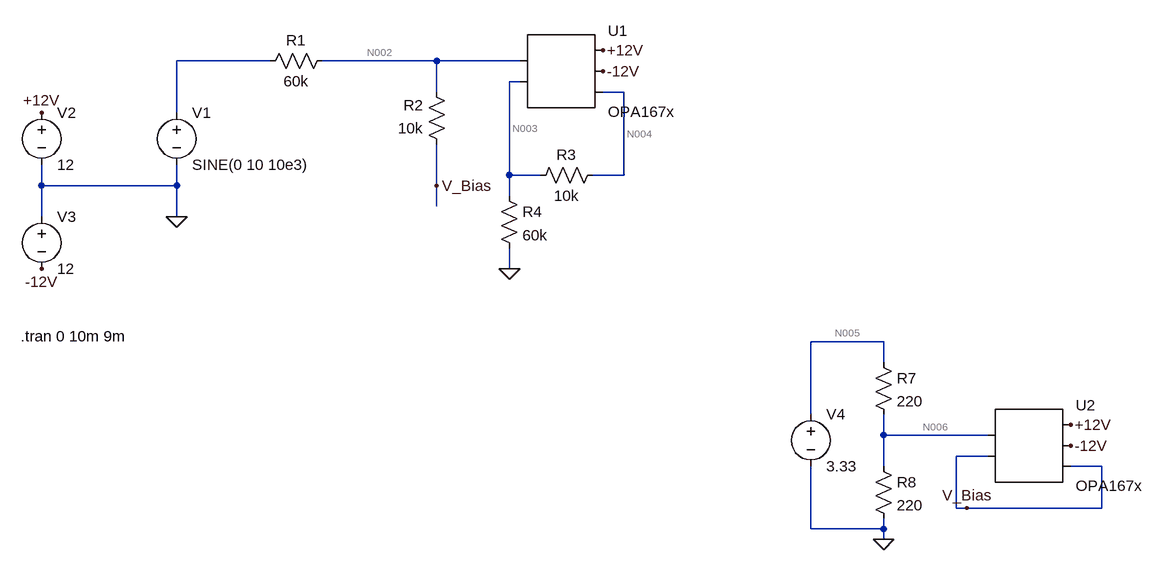
[diagram p0: schematic AnalogInput.asc]
* AnalogInput.asc
V1 N001 0 SINE(0 10 10e3)
V2 +12V 0 12
V3 0 -12V 12
* U1: OPA167x (symbol AutoGenerated\OPA167x not available, pins judged from their places): pin1=N002 pin2=N003 pin3=+12V pin4=-12V pin5=N004
R1 N002 N001 60k
R2 V_Bias N002 10k
R3 N003 N004 10k
R4 N003 0 60k
* U2: OPA167x (symbol AutoGenerated\OPA167x not available, pins judged from their places): pin1=N006 pin2=V_Bias pin3=+12V pin4=-12V pin5=V_Bias
R7 N005 N006 220
R8 N006 0 220
V4 N005 0 3.33
.tran 0 10m 9m
.backanno
.end

* Results of the author's LTspice run, read from the files saved beside the schematic
* Operating Point, zero values left out:
*   V(+12v) = 12 V
*   V(-12v) = -12 V
*   V(n004) = 1.666 V
*   V(n002) = 1.428 V
*   V(n003) = 1.428 V
*   V(v_bias) = 1.665 V
*   V(n006) = 1.665 V
*   V(n005) = 3.33 V
*   I(R8) = 7.568 mA
*   I(R7) = 7.568 mA
*   I(R4) = 23.8 µA
*   I(R3) = -23.8 µA
*   I(R2) = 23.79 µA
*   I(R1) = 23.79 µA
*   I(V4) = -7.568 mA
*   I(V3) = -4 mA
*   I(V2) = -4.048 mA
*   I(V1) = 23.79 µA
*   Ix(u1:IN+) = 17.25 pA
*   Ix(u1:IN-) = 7.469 pA
*   Ix(u1:VCC) = 2.024 mA
*   Ix(u1:VEE) = -2 mA
*   Ix(u1:OUT) = -23.8 µA
*   Ix(u2:IN+) = 18.3 pA
*   Ix(u2:IN-) = 8.713 pA
*   Ix(u2:VCC) = 2.024 mA
*   Ix(u2:VEE) = -2 mA
*   Ix(u2:OUT) = -23.79 µA
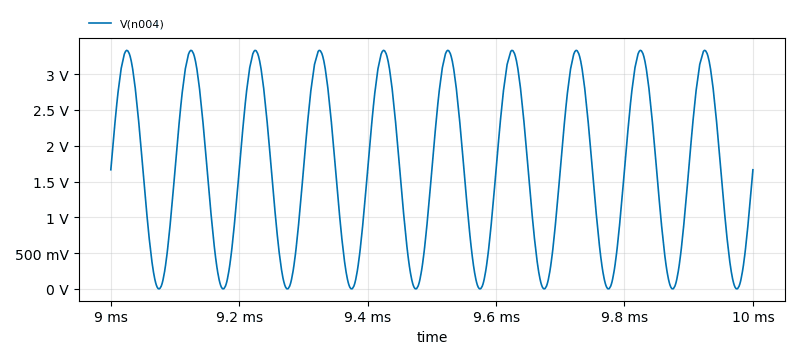
[diagram p1: Transient Analysis of AnalogInput.asc, plotted from the saved traces]
* Transient Analysis, 1 run:
*   V(n004): min 2.699 mV, max 3.332 V, average 1.665 V, rms 2.04 V, last 1.665 V